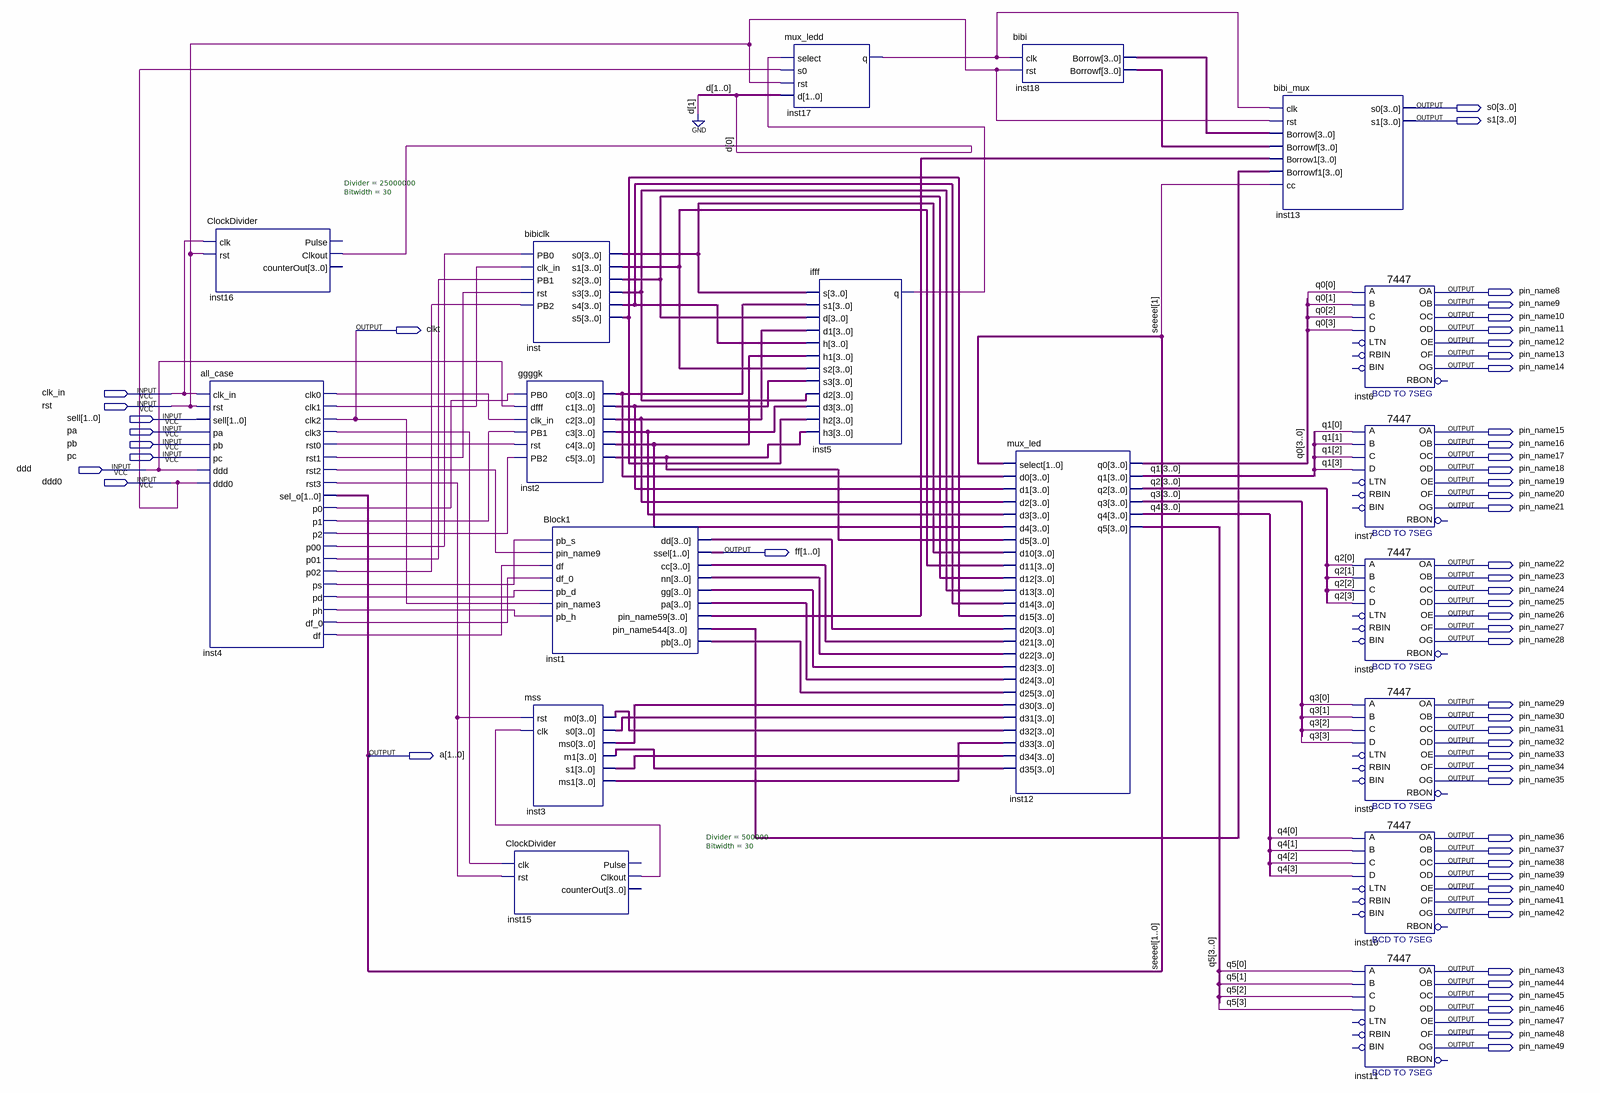
[diagram p0: schematic sheet]
// Quartus schematic ALL.bdf as structural Verilog: 18 symbols, 55 pins
module ALL (
  input  clk_in,
  input  rst,
  input  [1:0] sell,
  input  pa,
  input  pb,
  input  pc,
  input  ddd,
  input  ddd0,
  output [3:0] s0,
  output [3:0] s1,
  output pin_name8,
  output pin_name9,
  output pin_name10,
  output clkt,
  output pin_name11,
  output pin_name12,
  output pin_name13,
  output pin_name14,
  output pin_name15,
  output pin_name16,
  output pin_name17,
  output pin_name18,
  output pin_name19,
  output pin_name20,
  output pin_name21,
  output [1:0] ff,
  output pin_name22,
  output pin_name23,
  output pin_name24,
  output pin_name25,
  output pin_name26,
  output pin_name27,
  output pin_name28,
  output pin_name29,
  output pin_name30,
  output pin_name31,
  output pin_name32,
  output [1:0] a,
  output pin_name33,
  output pin_name34,
  output pin_name35,
  output pin_name36,
  output pin_name37,
  output pin_name38,
  output pin_name39,
  output pin_name40,
  output pin_name41,
  output pin_name42,
  output pin_name43,
  output pin_name44,
  output pin_name45,
  output pin_name46,
  output pin_name47,
  output pin_name48,
  output pin_name49
);

  wire inst4_clk0, inst4_clk1, inst4_clk3, inst4_df, inst4_df_0, inst4_p0, inst4_p00, inst4_p1, inst4_p01,
       inst4_p02, inst4_p2, inst4_pd, inst4_ph, inst4_ps, inst4_rst0, inst4_rst1, inst4_rst2, inst4_rst3,
       inst5_q, inst15_clkout, inst17_q;
  wire [0:0] d;
  wire [3:0] inst1_cc, inst1_dd, inst1_gg, inst1_nn, inst1_pa, inst1_pb, inst1_pin_name59, inst1_pin_name544,
       inst2_c0, inst2_c1, inst2_c2, inst2_c3, inst2_c4, inst2_c5, inst3_m0, inst3_m1, inst3_ms0, inst3_ms1,
       inst3_s0, inst3_s1, inst18_borrow, inst18_borrowf, inst_s0, inst_s1, inst_s2, inst_s3, inst_s4,
       inst_s5, q0, q1, q2, q3, q4, q5;

  ClockDivider #(.Divider(25000000), .Bitwidth(30)) inst16 (
    .clk(clk_in), .rst(rst), .Clkout(d[0]));  // open: Pulse, counterOut
  all_case inst4 (
    .clk_in(clk_in), .rst(rst), .sell(sell), .pa(pa), .pb(pb), .pc(pc), .ddd(ddd), .ddd0(ddd0),
    .clk0(inst4_clk0), .clk1(inst4_clk1), .clk2(clkt), .clk3(inst4_clk3), .rst0(inst4_rst0),
    .rst1(inst4_rst1), .rst2(inst4_rst2), .rst3(inst4_rst3), .sel_o(a), .p0(inst4_p0), .p1(inst4_p1),
    .p2(inst4_p2), .p00(inst4_p00), .p01(inst4_p01), .p02(inst4_p02), .ps(inst4_ps), .pd(inst4_pd),
    .ph(inst4_ph), .df_0(inst4_df_0), .df(inst4_df));
  ggggk inst2 (
    .PB0(inst4_p0), .dfff(ddd), .clk_in(inst4_clk0), .PB1(inst4_p1), .rst(inst4_rst0), .PB2(inst4_p2),
    .c0(inst2_c0), .c1(inst2_c1), .c2(inst2_c2), .c3(inst2_c3), .c4(inst2_c4), .c5(inst2_c5));
  ClockDivider #(.Divider(500000), .Bitwidth(30)) inst15 (
    .clk(inst4_clk3), .rst(inst4_rst3), .Clkout(inst15_clkout));  // open: Pulse, counterOut
  bibiclk inst (
    .PB0(inst4_p00), .clk_in(inst4_clk1), .PB1(inst4_p01), .rst(inst4_rst1), .PB2(inst4_p02), .s0(inst_s0),
    .s1(inst_s1), .s2(inst_s2), .s3(inst_s3), .s4(inst_s4), .s5(inst_s5));
  Block1 inst1 (
    .pb_s(inst4_ps), .pin_name9(inst4_rst2), .df(inst4_df), .df_0(inst4_df_0), .pb_d(inst4_pd),
    .pin_name3(clkt), .pb_h(inst4_ph), .dd(inst1_dd), .ssel(ff), .cc(inst1_cc), .nn(inst1_nn), .gg(inst1_gg),
    .pa(inst1_pa), .pin_name59(inst1_pin_name59), .pin_name544(inst1_pin_name544), .pb(inst1_pb));
  mss inst3 (
    .rst(inst4_rst3), .clk(inst15_clkout), .m0(inst3_m0), .s0(inst3_s0), .ms0(inst3_ms0), .m1(inst3_m1),
    .s1(inst3_s1), .ms1(inst3_ms1));
  mux_ledd inst17 (.select(inst5_q), .s0(ddd0), .rst(rst), .d({1'b0, d[0]}), .q(inst17_q));
  ifff inst5 (
    .s(inst_s0), .s1(inst2_c0), .d(inst_s2), .d1(inst2_c2), .h(inst_s4), .h1(inst2_c4), .s2(inst_s1),
    .s3(inst2_c1), .d2(inst_s3), .d3(inst2_c3), .h2(inst_s5), .h3(inst2_c5), .q(inst5_q));
  bibi inst18 (.clk(inst17_q), .rst(rst), .Borrow(inst18_borrow), .Borrowf(inst18_borrowf));
  mux_led inst12 (
    .select(a), .d0(inst2_c0), .d1(inst2_c1), .d2(inst2_c2), .d3(inst2_c3), .d4(inst2_c4), .d5(inst2_c5),
    .d10(inst_s0), .d11(inst_s1), .d12(inst_s2), .d13(inst_s3), .d14(inst_s4), .d15(inst_s5), .d20(inst1_dd),
    .d21(inst1_cc), .d22(inst1_nn), .d23(inst1_gg), .d24(inst1_pa), .d25(inst1_pb), .d30(inst3_ms0),
    .d31(inst3_s0), .d32(inst3_m0), .d33(inst3_ms1), .d34(inst3_s1), .d35(inst3_m1), .q0(q0), .q1(q1),
    .q2(q2), .q3(q3), .q4(q4), .q5(q5));
  bibi_mux inst13 (
    .clk(inst17_q), .rst(rst), .Borrow(inst18_borrow), .Borrowf(inst18_borrowf), .Borrow1(inst1_pin_name59),
    .Borrowf1(inst1_pin_name544), .cc(a[1]), .s0(s0), .s1(s1));
  \7447  inst6 (
    .B(q0[1]), .C(q0[2]), .D(q0[3]), .A(q0[0]), .OB(pin_name9), .OC(pin_name10), .OE(pin_name12),
    .OD(pin_name11), .OF(pin_name13), .OG(pin_name14), .OA(pin_name8));  // open: LTN, RBIN, BIN, RBON
  \7447  inst7 (
    .B(q1[1]), .C(q1[2]), .D(q1[3]), .A(q1[0]), .OB(pin_name16), .OC(pin_name17), .OE(pin_name19),
    .OD(pin_name18), .OF(pin_name20), .OG(pin_name21), .OA(pin_name15));  // open: LTN, RBIN, BIN, RBON
  \7447  inst8 (
    .B(q2[1]), .C(q2[2]), .D(q2[3]), .A(q2[0]), .OB(pin_name23), .OC(pin_name24), .OE(pin_name26),
    .OD(pin_name25), .OF(pin_name27), .OG(pin_name28), .OA(pin_name22));  // open: LTN, RBIN, BIN, RBON
  \7447  inst9 (
    .B(q3[1]), .C(q3[2]), .D(q3[3]), .A(q3[0]), .OB(pin_name30), .OC(pin_name31), .OE(pin_name33),
    .OD(pin_name32), .OF(pin_name34), .OG(pin_name35), .OA(pin_name29));  // open: LTN, RBIN, BIN, RBON
  \7447  inst10 (
    .B(q4[1]), .C(q4[2]), .D(q4[3]), .A(q4[0]), .OB(pin_name37), .OC(pin_name38), .OE(pin_name40),
    .OD(pin_name39), .OF(pin_name41), .OG(pin_name42), .OA(pin_name36));  // open: LTN, RBIN, BIN, RBON
  \7447  inst11 (
    .B(q5[1]), .C(q5[2]), .D(q5[3]), .A(q5[0]), .OB(pin_name44), .OC(pin_name45), .OE(pin_name47),
    .OD(pin_name46), .OF(pin_name48), .OG(pin_name49), .OA(pin_name43));  // open: LTN, RBIN, BIN, RBON

  // Other names for the same wires on the sheet: seeeel[1:0] = a
endmodule
